# Altium schematic sheet P09_USER LED_FAN_WD_RTC.SchDoc
size 420 x 297 mm
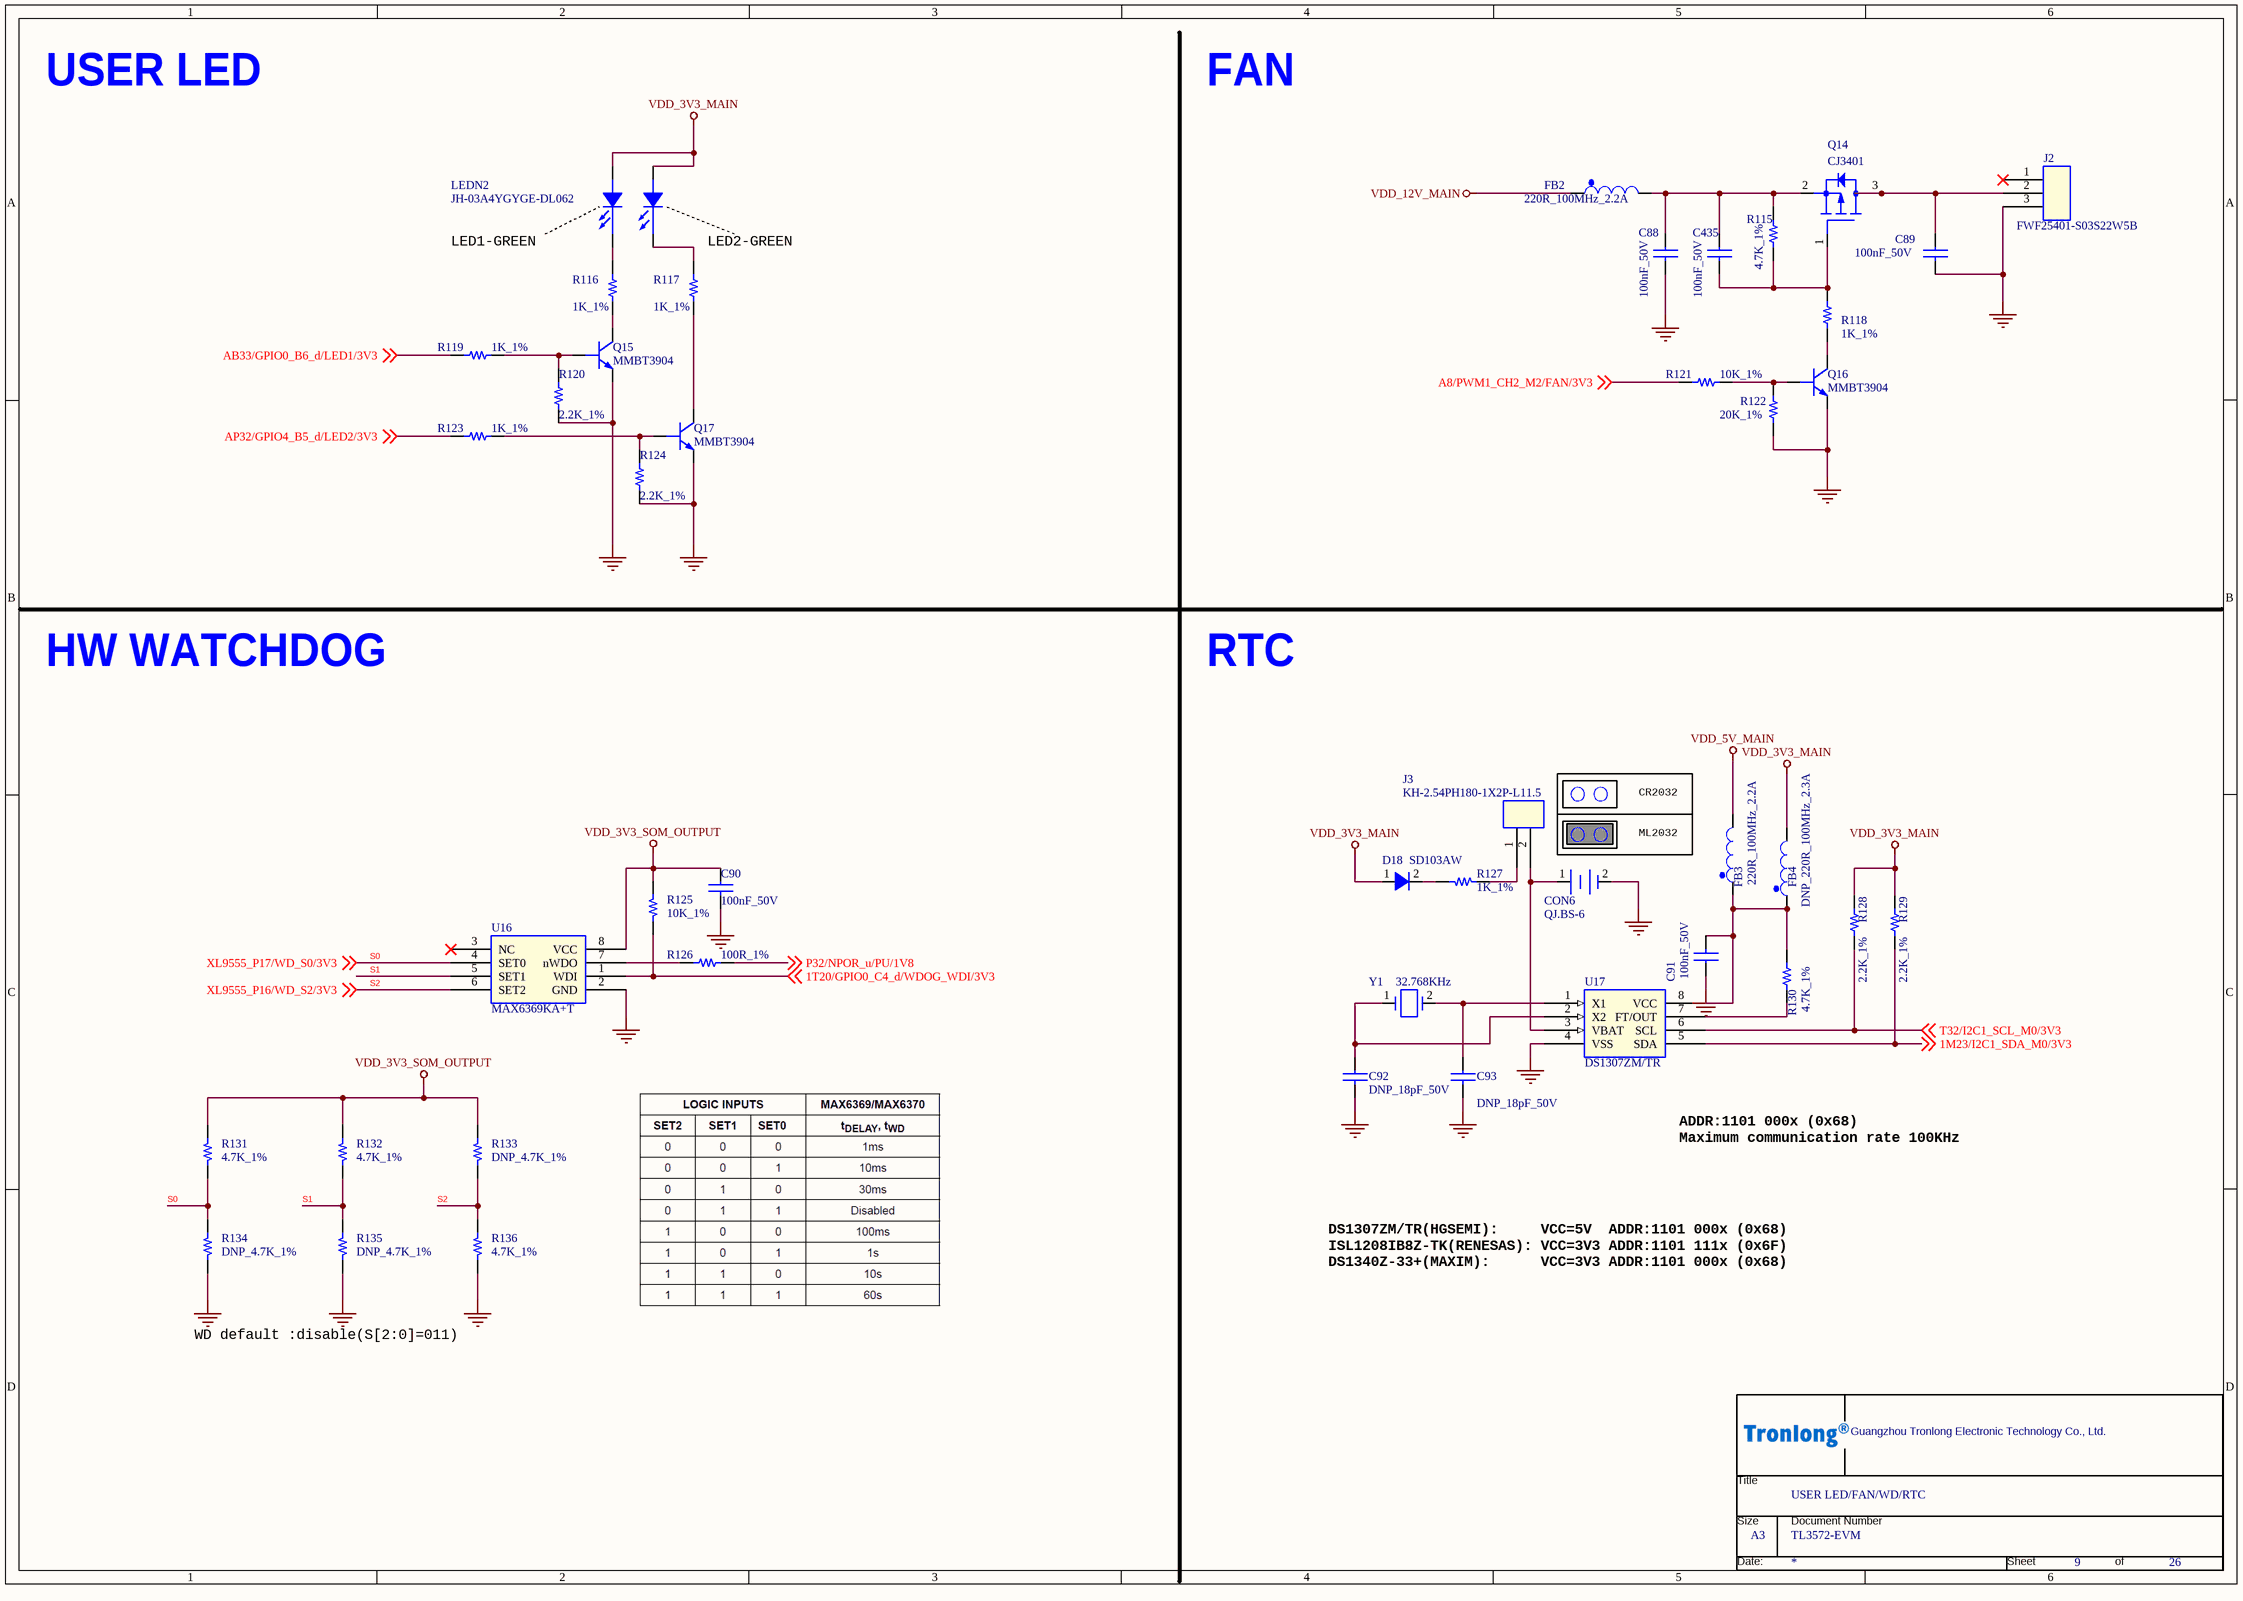
[diagram p0: P09_USER LED_FAN_WD_RTC.SchDoc]

## Parts
*  Page Count: 26  Page Number: 9  Page Size: A3  OrgName: Guangzhou Tronlong Electronic Technology Co., Ltd.  Title: USER LED/FAN/WD/RTC  Doc: TL3572-EVM  (hidden comment: TL_NEW)  (graphical)
C88  100nF_50V  [C0402]
C89  100nF_50V  [C0402]
C90  100nF_50V  [C0402]
C91  100nF_50V  [C0402]
C92  DNP_18pF_50V  [C0603]
C93  DNP_18pF_50V  [C0603]
C435  100nF_50V  [C0402]
CON6  QJ.BS-6  [CON_BATTERY_CR2032]
D18  SD103AW  [SOD-123_NEW]
FB2  220R_100MHz_2.2A  [L0603]
FB3  220R_100MHz_2.2A  [L0603]
FB4  DNP_220R_100MHz_2.3A  [L0603]
J2  FWF25401-S03S22W5B  [mol22-23-2031]
J3  KH-2.54PH180-1X2P-L11.5  [header_1x2p_2d54_male]
LEDN2  JH-03A4YGYGE-DL062  [led-th_4p-l12d8-w4d6]
Q14  CJ3401  [SOT23-3]
Q15  MMBT3904  [SOT23-3_DBZ3]
Q16  MMBT3904  [SOT23-3_DBZ3]
Q17  MMBT3904  [SOT23-3_DBZ3]
R115  4.7K_1%  [R0402]
R116  1K_1%  [R0603]
R117  1K_1%  [R0603]
R118  1K_1%  [R0603]
R119  1K_1%  [R0402]
R120  2.2K_1%  [R0603]
R121  10K_1%  [R0402]
R122  20K_1%  [R0603]
R123  1K_1%  [R0603]
R124  2.2K_1%  [R0603]
R125  10K_1%  [R0402]
R126  100R_1%  [R0402]
R127  1K_1%  [R0603]
R128  2.2K_1%  [R0603]
R129  2.2K_1%  [R0603]
R130  4.7K_1%  [R0402]
R131  4.7K_1%  [R0402]
R132  4.7K_1%  [R0402]
R133  DNP_4.7K_1%  [R0402]
R134  DNP_4.7K_1%  [R0402]
R135  DNP_4.7K_1%  [R0402]
R136  4.7K_1%  [R0402]
U16  MAX6369KA+T  [sot23_8]
U17  DS1307ZM/TR  [SOIC8_D8]
Y1  32.768KHz  [SMD_2012]

## Nets
GND: C88.2 C89.2 C90.2 C91.1 C92.2 C93.2 CON6.2(-) J2.3 Q15.2(E) Q16.2(E) Q17.2(E) R120.1 R122.2 R124.1 R134.2 R135.2 R136.2 U16.2(GND) U17.4(VSS)
VDD_3V3_MAIN: D18.1(Anode) FB4.2 LEDN2.2(ANODE1) LEDN2.3(ANODE2) R128.1 R129.1
VDD_3V3_SOM_OUTPUT: C90.1 R125.1 R131.1 R132.1 R133.1 U16.8(VCC)
VDD_5V_MAIN: FB3.2
VDD_12V_MAIN: FB2.1
1M23/I2C1_SDA_M0/3V3: R129.2 U17.5(SDA) ; off-sheet 1M23/I2C1_SDA_M0/3V3
1T20/GPIO0_C4_d/WDOG_WDI/3V3: R125.2 U16.1(WDI) ; off-sheet 1T20/GPIO0_C4_d/WDOG_WDI/3V3
A8/PWM1_CH2_M2/FAN/3V3: R121.1 ; off-sheet A8/PWM1_CH2_M2/FAN/3V3
AB33/GPIO0_B6_d/LED1/3V3: R119.2 ; off-sheet AB33/GPIO0_B6_d/LED1/3V3
AP32/GPIO4_B5_d/LED2/3V3: R123.2 ; off-sheet AP32/GPIO4_B5_d/LED2/3V3
P32/NPOR_u/PU/1V8: R126.2 ; off-sheet P32/NPOR_u/PU/1V8
S0: R131.2 R134.1 U16.4(SET0) ; off-sheet XL9555_P17/WD_S0/3V3  [also labelled XL9555_P17/WD_S0/3V3]
S1: R132.2 R135.1 U16.5(SET1)
S2: R133.2 R136.1 U16.6(SET2) ; off-sheet XL9555_P16/WD_S2/3V3  [also labelled XL9555_P16/WD_S2/3V3]
T32/I2C1_SCL_M0/3V3: R128.2 U17.6(SCL) ; off-sheet T32/I2C1_SCL_M0/3V3
NetC88_1: C88.1 C435.1 FB2.2 Q14.2(SOURCE) R115.1
NetC89_1: C89.1 J2.2 Q14.3(DRAIN)
NetC91_2: C91.2 FB3.1 FB4.1 R130.1 U17.8(VCC)
NetC92_1: C92.1 U17.2(X2) Y1.1
NetC93_1: C93.1 U17.1(X1) Y1.2
NetC435_2: C435.2 Q14.1(GATE) R115.2 R118.1
NetCON6_1: CON6.1(+) J3.2 U17.3(VBAT)
NetD18_2: D18.2(Cathode) R127.2
NetJ3_1: J3.1 R127.1
NetLEDN2_1: LEDN2.1(CATHODE1) R116.2
NetLEDN2_4: LEDN2.4(CATHODE2) R117.2
NetQ15_1: Q15.1(B) R119.1 R120.2
NetQ15_3: Q15.3(C) R116.1
NetQ16_1: Q16.1(B) R121.2 R122.1
NetQ16_3: Q16.3(C) R118.2
NetQ17_1: Q17.1(B) R123.1 R124.2
NetQ17_3: Q17.3(C) R117.1
NetR126_1: R126.1 U16.7(nWDO)
NetR130_2: R130.2 U17.7(FT/OUT)

Not connected (* = marked no-connect by the designer): J2 1*; U16 3(NC)*

## Notes on the sheet
- USER LED
- FAN
- LED1-GREEN
- (near R117) LED2-GREEN
- HW WATCHDOG
- RTC
- CR2032
- ML2032
- ADDR:1101 000x (0x68)
  Maximum communication rate 100KHz
- DS1307ZM/TR(HGSEMI):     VCC=5V  ADDR:1101 000x (0x68)
  ISL1208IB8Z-TK(RENESAS): VCC=3V3 ADDR:1101 111x (0x6F)
  DS1340Z-33+(MAXIM):      VCC=3V3 ADDR:1101 000x (0x68)
- WD default :disable(S[2:0]=011)
- (in symbol TL_NEW) Title; Size; Document Number; Date:; Sheet; of

## Library data of the parts
* = TL_NEW: RevCode: A?; Page Create Date: March  8, 1995; Page Modify Date: *; Document: TL3572-EVM
C88 C89 C435 = CAP NP_Dup2: 贴片陶瓷电容,100nF,10%,50V,X7R; Manufacturer PartNumber: 0402B104K500NT; Manufacturer Character: 中国大陆; Manufacturer: 广东风华高新科技股份有限公司（FH）; Eco-Label: ROHS; ERP Number: 005.0001.0001.00681; As-Welded: /; Operation Temperature（℃）: -55~+125(Ta); PCB Footprint: C0402; Part Status: 试用
C90 = CAP NP_Dup2: 贴片陶瓷电容,100nF,10%,50V,X7R; Manufacturer PartNumber: 0402B104K500NT; Manufacturer: 广东风华高新科技股份有限公司（FH）; Manufacturer Character: 中国大陆; ERP Number: 005.0001.0001.00681; As-Welded: /; Operation Temperature（℃）: -55~+125(Ta); Eco-Label: ROHS; PCB Footprint: C0402; Part Status: 试用; Temperature: -55~125℃
C91 = CAP NP_Dup2: 贴片陶瓷电容,100nF,10%,50V,X7R; Manufacturer Character: 中国大陆; Manufacturer PartNumber: 0402B104K500NT; Manufacturer: 广东风华高新科技股份有限公司（FH）; Eco-Label: ROHS; ERP Number: 005.0001.0001.00681; Operation Temperature（℃）: -55~+125(Ta); As-Welded: /; PCB Footprint: C0402; Part Status: 试用; Temperature: -55~125℃
C92 C93 = CAP NP_Dup2: 贴片陶瓷电容,18pF,5%,50V,COG; Manufacturer Character: 中国大陆; Manufacturer PartNumber: 0603CG180J500NT; Manufacturer: 广东风华高新科技股份有限公司（FH）; Eco-Label: ROHS; ERP Number: 005.0001.0001.00619; Operation Temperature（℃）: -55~+125(Ta); As-Welded: DNP; PCB Footprint: C0603; Part Status: 试用; Temperature: -40~125℃
CON6 = BATTERY: 贴片纽扣电池座,CR2032,2P,180度; Manufacturer Character: 中国大陆; Manufacturer: 深圳市琦捷电子有限公司（QIJEY）; Eco-Label: ROHS; ERP Number: 005.0001.0003.00097; Operation Temperature（℃）: /; room: 4; PCB Footprint: CON_BATTERY_CR2032; Part Status: 优选; Temperature: -55~85℃; Manufacturer PartNumber: QJ.BS-6; As-Welded: /
D18 = Diode200mA250V_1: 肖特基二极管,VR=40V,IF=350mA,VF=0.37V@20mA,trr=10ns; TIIntPartnumber: 1E0013; MfrNum: MMSD103T1G; Mfr: On Semiconductor; Manufacturer: 江苏长晶科技股份有限公司（JSCJ）; Manufacturer Character: 中国大陆; DescriptiveText: Diode 200mA 250V 1.25V Forward Drop; PCB Footprint: smd123; Cost10K: 0.07; Cost100: 0.23; Vendor: Digikey; Eco-Label: ROHS; ERP Number: 005.0001.0010.00103; As-Welded: /; Operation Temperature（℃）: -40~+125(Tj); PartName: Diode200mA250V; Descriptive_Text: Diode 200mA 250V 1.25V Forward Drop; Part Status: 优选; Manufacturer PartNumber: SD103AW; Temperature: -55~150℃
FB2 = FB_0: 磁珠,50mΩ,2.2A,220R@100MHz; Manufacturer Character: 中国大陆; Manufacturer PartNumber: UPZ1608U221-2R2TF; Manufacturer: 深圳顺络电子股份有限公司（Sunlord）; Operation Temperature（℃）: -55~+125(Ta); Eco-Label: ROHS; ERP Number: 005.0001.0007.00015; As-Welded: /; PCB Footprint: L0603; Temperature: -55~125℃; Part Status: 限选
FB3 = FERRITE BEAD_Dup1: 磁珠,50mΩ,2.2A,220R@100MHz; Manufacturer Character: 中国大陆; Manufacturer PartNumber: UPZ1608U221-2R2TF; Manufacturer: 深圳顺络电子股份有限公司（Sunlord）; Eco-Label: ROHS; ERP Number: 005.0001.0007.00015; As-Welded: /; Operation Temperature（℃）: -55~+125(Ta); room: RGMII1; PCB Footprint: L0603; Part Status: 限选; Temperature: -55~125℃
FB4 = FERRITE BEAD_Dup1: 磁珠,50mΩ,2.3A,220R@100MHz; Manufacturer Character: 中国大陆; Manufacturer: 深圳顺络电子股份有限公司（Sunlord）; Manufacturer PartNumber: UPZ1608U221-2R3TF; Eco-Label: ROHS; ERP Number: 005.0001.0007.00023; Operation Temperature（℃）: -55~+125(Ta); room: RGMII1; As-Welded: DNP; PCB Footprint: L0603; Part Status: 测评; Temperature: -55~125℃
J2 = CON3: 插件针座连接器,3P,间距2.54mm,180度,白色; Manufacturer: 深圳特思嘉工业电子有限公司（TXGA）; Manufacturer Character: 中国大陆; Operation Temperature（℃）: -25~+85(Ta); As-Welded: /; ERP Number: 005.0001.0003.00499; Eco-Label: ROHS; PCB Footprint: mol22-23-2031; Part Status: 优选; Temperature: -25~85℃; Manufacturer PartNumber: FWF25401-S03S22W5B
J3 = CON2_0: 插件单排排针,1x2P,2.54mm,180度; Manufacturer: 深圳市金航标电子有限公司(kinghelm); Manufacturer Character: 中国大陆; As-Welded: /; Operation Temperature（℃）: -40~+105(Ta); ERP Number: 005.0001.0003.00566; Eco-Label: ROHS; PCB Footprint: header_1x2p_2d54_male; Temperature: -40~105℃; Manufacturer PartNumber: KH-2.54PH180-1X2P-L11.5; Part Status: 优选
LEDN2 = LED_4: 直插式发光二极管,绿色,带灯座; Manufacturer Character: 中国大陆; Manufacturer: 深圳市巨弘光电有限公司（JUHLIGHT）; Manufacturer PartNumber: JH-03B2YG1E-DL; Eco-Label: ROHS; ERP Number: 005.0001.0010.00148; As-Welded: /; Operation Temperature（℃）: -40~+100(Ta); Part Status: 试用; Temperature: -40~105℃; PCB Footprint: led-th_4p-l12d8-w4d6
Q14 = MOSFET P SOT_Dup1: MOSFET,P沟道,VDSS=-30V,VGSS=±12V,ID=-4.2A,PD=0.35W,VGS(th)=-1.3V; Manufacturer: 江苏长晶科技股份有限公司（JSCJ）; Manufacturer Character: 中国大陆; Eco-Label: ROHS; ERP Number: 005.0001.0009.00015; room: DCIN; Operation Temperature（℃）: -55~+150(Tj); As-Welded: /; PCB Footprint: SOT23-3; Manufacturer Part Number: CJ3401; Manufacturer PartNumber: CJ3401; Temperature: -55~150℃; Part Status: 优选
Q15 = MMBT3904/SOT: BJT,NPN,Vceo=40V,Ic=200mA,fT=300MHz,PD=200mW; Manufacturer Character: 中国大陆; Manufacturer: 江苏长晶科技股份有限公司（JSCJ）; Operation Temperature（℃）: -55~+150(Tj); As-Welded: /; ERP Number: 005.0001.0008.00002; Eco-Label: ROHS; PCB Footprint: SOT23-3_DBZ3; Temperature: -55~150℃; Manufacturer PartNumber: MMBT3904; Part Status: 优选
Q16 = MMBT3904/SOT: BJT,NPN,Vceo=40V,Ic=200mA,fT=300MHz,PD=200mW; Manufacturer: 江苏长晶科技股份有限公司（JSCJ）; Manufacturer Character: 中国大陆; Eco-Label: ROHS; ERP Number: 005.0001.0008.00002; Operation Temperature（℃）: -55~+150(Tj); As-Welded: /; PCB Footprint: SOT23-3_DBZ3; Temperature: -55~150℃; Manufacturer PartNumber: MMBT3904; Part Status: 优选
Q17 = MMBT3904/SOT: BJT,NPN,Vceo=40V,Ic=200mA,fT=300MHz,PD=200mW; Manufacturer: 江苏长晶科技股份有限公司（JSCJ）; Manufacturer Character: 中国大陆; Operation Temperature（℃）: -55~+150(Tj); As-Welded: /; ERP Number: 005.0001.0008.00002; Eco-Label: ROHS; PCB Footprint: SOT23-3_DBZ3; Manufacturer PartNumber: MMBT3904; Temperature: -55~150℃; Part Status: 优选
R115 = Resistor_Dup3: 贴片电阻,4.7K,±1%,1/16W; Manufacturer: 广东风华高新科技股份有限公司（FH）; Manufacturer Character: 中国大陆; Mistral Part No: 110009031036-R; Mfr_name: PANASONIC-ECG; Mfr_part_number: ERJ-2RNF6981V; Part_type: RESISTORS\FIXED; Manufacturer PartNumber: RC-02K4701FT; CLASS: DISCRETE; Operation Temperature（℃）: -55~+125(Ta); As-Welded: /; Project: TELEMETRY ENCODER; ERP Number: 005.0001.0002.01359; Eco-Label: ROHS; PCB Footprint: R0402; Part Status: 试用; Package: 0402; Distributor_name: NA; Distributor_part_number: NA; Height: 0.40MM
R116 = Resistor_Dup4: 贴片电阻,1K,±1%,1/10W; Manufacturer PartNumber: RS-03K1001FT; Manufacturer: 广东风华高新科技股份有限公司（FH）; Manufacturer Character: 中国大陆; CLASS: DISCRETE; Eco-Label: ROHS; ERP Number: 005.0001.0002.00961; As-Welded: /; Operation Temperature（℃）: -55~+155(Ta); PCB Footprint: R0603; Part Status: 优选
R117 = Resistor_Dup4: 贴片电阻,1K,±1%,1/10W; Manufacturer: 广东风华高新科技股份有限公司（FH）; Manufacturer PartNumber: RS-03K1001FT; Manufacturer Character: 中国大陆; CLASS: DISCRETE; Eco-Label: ROHS; ERP Number: 005.0001.0002.00961; As-Welded: /; Operation Temperature（℃）: -55~+155(Ta); PCB Footprint: R0603; Part Status: 优选
R118 = Resistor_Dup3: 贴片电阻,1K,±1%,1/10W; Manufacturer: 广东风华高新科技股份有限公司（FH）; Manufacturer Character: 中国大陆; Mistral Part No: 110009031036-R; Mfr_name: PANASONIC-ECG; Mfr_part_number: ERJ-2RNF6981V; Part_type: RESISTORS\FIXED; Manufacturer PartNumber: RS-03K1001FT; CLASS: DISCRETE; Eco-Label: ROHS; ERP Number: 005.0001.0002.00961; Operation Temperature（℃）: -55~+155(Ta); As-Welded: /; Project: TELEMETRY ENCODER; PCB Footprint: R0603; Package: 0402; Distributor_name: NA; Distributor_part_number: NA; Height: 0.40MM; Part Status: 优选
R119 = Resistor_Dup4: 贴片电阻,1K,±1%,1/16W; Manufacturer PartNumber: RC-02K1001FT; Manufacturer: 广东风华高新科技股份有限公司（FH）; Manufacturer Character: 中国大陆; CLASS: DISCRETE; Operation Temperature（℃）: -55~+125(Ta); As-Welded: /; ERP Number: 005.0001.0002.01327; Eco-Label: ROHS; PCB Footprint: R0402; Part Status: 优选
R120 = Resistor_Dup4: 贴片电阻,2.2K,±1%,1/10W; Manufacturer: 广东风华高新科技股份有限公司（FH）; Manufacturer PartNumber: RS-03K2201FT; Manufacturer Character: 中国大陆; CLASS: DISCRETE; Operation Temperature（℃）: -55~+155(Ta); As-Welded: /; ERP Number: 005.0001.0002.00972; Eco-Label: ROHS; PCB Footprint: R0603; Part Status: 优选
R121 = Resistor_Dup3: 贴片电阻,10K,±1%,1/16W; Manufacturer PartNumber: RC-02K1002FT; Mistral Part No: 110009031036-R; Mfr_name: PANASONIC-ECG; Mfr_part_number: ERJ-2RNF6981V; Part_type: RESISTORS\FIXED; Manufacturer Character: 中国大陆; Manufacturer: 广东风华高新科技股份有限公司（FH）; CLASS: DISCRETE; Project: TELEMETRY ENCODER; As-Welded: /; Operation Temperature（℃）: -55~+125(Ta); ERP Number: 005.0001.0002.01326; Eco-Label: ROHS; PCB Footprint: R0402; Part Status: 优选; Package: 0402; Distributor_name: NA; Distributor_part_number: NA; Height: 0.40MM
R122 = Resistor_Dup3: 贴片电阻,20K,±1%,1/10W; Manufacturer: 广东风华高新科技股份有限公司（FH）; Manufacturer PartNumber: RS-03K2002FT; Manufacturer Character: 中国大陆; Part_type: RESISTORS\FIXED; Mfr_part_number: ERJ-2RNF6981V; Mfr_name: PANASONIC-ECG; Mistral Part No: 110009031036-R; CLASS: DISCRETE; Operation Temperature（℃）: -55~+155(Ta); As-Welded: /; Project: TELEMETRY ENCODER; ERP Number: 005.0001.0002.01054; Eco-Label: ROHS; PCB Footprint: R0603; Part Status: 优选; Height: 0.40MM; Distributor_part_number: NA; Distributor_name: NA; Package: 0402
R123 = Resistor_Dup4: 贴片电阻,1K,±1%,1/10W; Manufacturer Character: 中国大陆; Manufacturer PartNumber: RS-03K1001FT; Manufacturer: 广东风华高新科技股份有限公司（FH）; CLASS: DISCRETE; Eco-Label: ROHS; ERP Number: 005.0001.0002.00961; As-Welded: /; Operation Temperature（℃）: -55~+155(Ta); PCB Footprint: R0603; Part Status: 优选
R124 = Resistor_Dup4: 贴片电阻,2.2K,±1%,1/10W; Manufacturer PartNumber: RS-03K2201FT; Manufacturer: 广东风华高新科技股份有限公司（FH）; Manufacturer Character: 中国大陆; CLASS: DISCRETE; Eco-Label: ROHS; ERP Number: 005.0001.0002.00972; As-Welded: /; Operation Temperature（℃）: -55~+155(Ta); PCB Footprint: R0603; Part Status: 优选
R125 = Resistor_Dup4: 贴片电阻,10K,±1%,1/16W; Manufacturer: 广东风华高新科技股份有限公司（FH）; Manufacturer PartNumber: RC-02K1002FT; Manufacturer Character: 中国大陆; CLASS: DISCRETE; Eco-Label: ROHS; ERP Number: 005.0001.0002.01326; Operation Temperature（℃）: -55~+125(Ta); As-Welded: /; PCB Footprint: R0402; ERP PCB Footprint: R0402; Part Status: 优选
R126 = Resistor_Dup4: 贴片电阻,100R,±1%,1/16W; Manufacturer Character: 中国大陆; Manufacturer PartNumber: RC-02K1000FT; Manufacturer: 广东风华高新科技股份有限公司（FH）; CLASS: DISCRETE; As-Welded: /; Operation Temperature（℃）: -55~+155(Ta); ERP Number: 005.0001.0002.01314; Eco-Label: ROHS; Part Status: 试用; Temperature: -55~155℃; ERP PCB Footprint: R0402; PCB Footprint: R0402
R127 = Resistor_Dup3: 贴片电阻,1K,±1%,1/10W; Manufacturer PartNumber: RS-03K1001FT; Manufacturer: 广东风华高新科技股份有限公司（FH）; Manufacturer Character: 中国大陆; CLASS: DISCRETE; Eco-Label: ROHS; ERP Number: 005.0001.0002.00961; As-Welded: /; Operation Temperature（℃）: -55~+155(Ta); room: EEPROM/RTC; PCB Footprint: R0603; Part Status: 优选
R128 R129 = Resistor_Dup4: 贴片电阻,2.2K,±1%,1/10W; Manufacturer: 广东风华高新科技股份有限公司（FH）; Manufacturer PartNumber: RS-03K2201FT; Manufacturer Character: 中国大陆; CLASS: DISCRETE; Operation Temperature（℃）: -55~+155(Ta); DNP: /; ERP Number: 005.0001.0002.00972; Eco-Label: ROHS; PCB Footprint: R0603; Part Status: 优选; Temperature: -55~155℃; As-Welded: /
R130 = Resistor_Dup3: 贴片电阻,4.7K,±1%,1/16W; Manufacturer Character: 中国大陆; Manufacturer PartNumber: RC-02K4701FT; Manufacturer: 广东风华高新科技股份有限公司（FH）; CLASS: DISCRETE; Eco-Label: ROHS; ERP Number: 005.0001.0002.01359; Operation Temperature（℃）: -55~+125(Ta); As-Welded: /; PCB Footprint: R0402; Part Status: 试用; Temperature: -55~155℃
R131 = Resistor_Dup3: 贴片电阻,4.7K,±1%,1/16W; Manufacturer PartNumber: RC-02K4701FT; Manufacturer: 广东风华高新科技股份有限公司（FH）; Manufacturer Character: 中国大陆; CLASS: DISCRETE; ERP Number: 005.0001.0002.01359; As-Welded: /; Operation Temperature（℃）: -55~+125(Ta); Eco-Label: ROHS; PCB Footprint: R0402; Part Status: 试用; Temperature: -55~155℃
R132 = Resistor_Dup3: 贴片电阻,4.7K,±1%,1/16W; Manufacturer Character: 中国大陆; Manufacturer: 广东风华高新科技股份有限公司（FH）; Manufacturer PartNumber: RC-02K4701FT; CLASS: DISCRETE; ERP Number: 005.0001.0002.01359; As-Welded: /; Operation Temperature（℃）: -55~+125(Ta); Eco-Label: ROHS; PCB Footprint: R0402; Part Status: 试用; Temperature: -55~155℃
R133 = Resistor_Dup3: RC0402FR-074K7L,0402WGF4701TCE; Manufacturer: 广州创龙; Manufacturer PartNumber: 4.7K,±1%,R0402,≥1/16W; CLASS: DISCRETE; Operation Temperature（℃）: -40~+85(Ta); As-Welded: DNP; ERP Number: 005.0001.0023.00160; Eco-Label: ROHS; PCB Footprint: R0402; Manufacturer Character: -; Temperature: -55~155℃; Part Status: -
R134 = Resistor_Dup3: RC0402FR-074K7L,0402WGF4701TCE; Manufacturer: 广州创龙; Manufacturer PartNumber: 4.7K,±1%,R0402,≥1/16W; CLASS: DISCRETE; ERP Number: 005.0001.0023.00160; Operation Temperature（℃）: -40~+85(Ta); As-Welded: DNP; Eco-Label: ROHS; PCB Footprint: R0402; Temperature: -55~155℃; Manufacturer Character: -; Part Status: -
R135 = Resistor_Dup3: RC0402FR-074K7L,0402WGF4701TCE; Manufacturer PartNumber: 4.7K,±1%,R0402,≥1/16W; Manufacturer: 广州创龙; CLASS: DISCRETE; Operation Temperature（℃）: -40~+85(Ta); As-Welded: DNP; ERP Number: 005.0001.0023.00160; Eco-Label: ROHS; PCB Footprint: R0402; Temperature: -55~155℃; Manufacturer Character: -; Part Status: -
R136 = Resistor_Dup3: 贴片电阻,4.7K,±1%,1/16W; Manufacturer: 广东风华高新科技股份有限公司（FH）; Manufacturer PartNumber: RC-02K4701FT; Manufacturer Character: 中国大陆; CLASS: DISCRETE; Eco-Label: ROHS; Operation Temperature（℃）: -55~+125(Ta); As-Welded: /; ERP Number: 005.0001.0002.01359; PCB Footprint: R0402; Temperature: -55~155℃; Part Status: 试用
U16 = MAX637x: 低电平有效开漏输出,2.5V-5.5V,-40~125℃; Manufacturer: Maxim Integrated（美国美信）; Manufacturer Character: 国外; ERP Number: 005.0001.0004.00509; Operation Temperature（℃）: -40~85(Ta); As-Welded: /; Eco-Label: ROHS; Part Status: 优选; Manufacturer PartNumber: MAX6369KA+T; Temperature: -40~125℃; PCB Footprint: sot23_8
U17 = IC_MCP79410_0: 实时时钟,VCC=4.5~5.5V,I2C; Manufacturer Character: 中国大陆; Manufacturer: 广东华冠半导体有限公司(HGSEMI); Eco-Label: ROHS; ERP Number: 005.0001.0004.00734; As-Welded: /; Operation Temperature（℃）: -40~+85(Ta); PCB Footprint: SOIC8_D8; Part Status: 优选; Temperature: -40~85℃; Manufacturer PartNumber: DS1307ZM/TR
Y1 = CRYS_32_768KHz_SMD: 两脚无源晶振,32.768KHz,±20ppm,12.5pF,80KΩ,±20ppm; PartName: Crystal32.768KHzMC306; Mfr: Epson; MfrNum: MC-30632.7680k-A; TIIntPartnumber: 1Y0029; Manufacturer Character: 中国大陆; Manufacturer PartNumber: SF20WK32768D31T007; Manufacturer: 泰晶科技股份有限公司(TKD); TN: tbd; Vendor: Digikey; Cost100: 0.41; Cost10K: 0.338; PCB Footprint: smd; Eco-Label: ROHS; ERP Number: 005.0001.0005.00086; Operation Temperature（℃）: -40~+85(Ta); As-Welded: /; Part Status: 优选; Temperature: -40~85℃